# Altium schematic sheet RS232 2 кан..SchDoc
size 297 x 209 mm
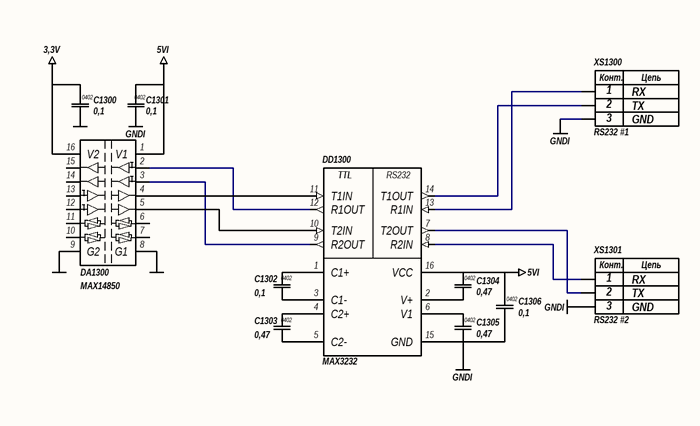
[diagram p0: RS232 2 кан..SchDoc]

## Parts
C1300  0,1  [CAP0402]
C1301  0,1  [CAP0402]
C1302  0,1  [CAP0402]
C1303  0,47  [CAP0402]
C1304  0,47  [CAP0402]
C1305  0,47  [CAP0402]
C1306  0,1  [CAP0402]
DA1300  MAX14850  [SO16]
DD1300  MAX3232  [SO16-3.9]
XS1300  RS232 #1  [MW-3M]
XS1301  RS232 #2  [MW-3M]

## Nets
3,3V: C1300.1 DA1300.16(V2)
5VI: C1301.1 C1304.1 C1306.1 DA1300.1(V1) DD1300.16(VCC)
GND: C1300.2 DA1300.8(G1) DA1300.9(G2)
GNDI: C1301.2 C1305.2 C1306.2 DD1300.15(GND) XS1300.3(GND) XS1301.3(GND)
NetC1302_1: C1302.1 DD1300.1(C1+)
NetC1302_2: C1302.2 DD1300.3(C1-)
NetC1303_1: C1303.1 DD1300.4(C2+)
NetC1303_2: C1303.2 DD1300.5(C2-)
NetC1304_2: C1304.2 DD1300.2(V+)
NetC1305_1: C1305.1 DD1300.6(V1)
NetDA1300_2: DA1300.2 DD1300.12(R1OUT)
NetDA1300_3: DA1300.3(INA) DD1300.9(R2OUT)
NetDA1300_4: DA1300.4(INB) DD1300.11(T1IN)
NetDA1300_5: DA1300.5(OUTC) DD1300.10(T2IN)
NetDD1300_7: DD1300.7(T2OUT) XS1301.2(TX)
NetDD1300_8: DD1300.8(R2IN) XS1301.1(RX)
NetDD1300_13: DD1300.13(R1IN) XS1300.1(RX)
NetDD1300_14: DD1300.14(T1OUT) XS1300.2(TX)

Not connected (* = marked no-connect by the designer): DA1300 6(NC) 7(EN1) 10(E2) 11 12 13 14 15

## Notes on the sheet
- (in symbol MAX3232) TTL; RS232
- (in symbol Разъем3_1) Конт.; Цепь

## Library data of the parts
C1300-C1306 = CAP_0402: Конденсатор чип; Тип корпуса: 0402; Тип монтажа: Поверхностный; Тип компонента: Конденсатор чип
  C1300-C1302 C1306: Value: 0,1; Номинал: 0,1
  C1303-C1305: Value: 0,47; Номинал: 0,47
DA1300 = MAX14850: Цифровой изолятор 2 вх 2 вых 2 вх/вых; Производитель: Maxim; Тип корпуса: QSOP16; Тип монтажа: Поверхностный; Характеристики: 2 Мбит/с; Наименование: MAX14850; Тип компонента: Цифровой изолятор 2 вх 2 вых 2 вх/вых
DD1300 = MAX3232: Интерфейс RS232 2 кан.; Производитель: Maxim Semiconductor; Тип корпуса: SO16; Тип монтажа: Поверхностный; Характеристики: 120кБит/с; Наименование: MAX3232; Тип компонента: Интерфейс RS232 2 кан.
XS1300 XS1301 = Разъем3_1: Разъем